# Altium project Servo.PrjPcb
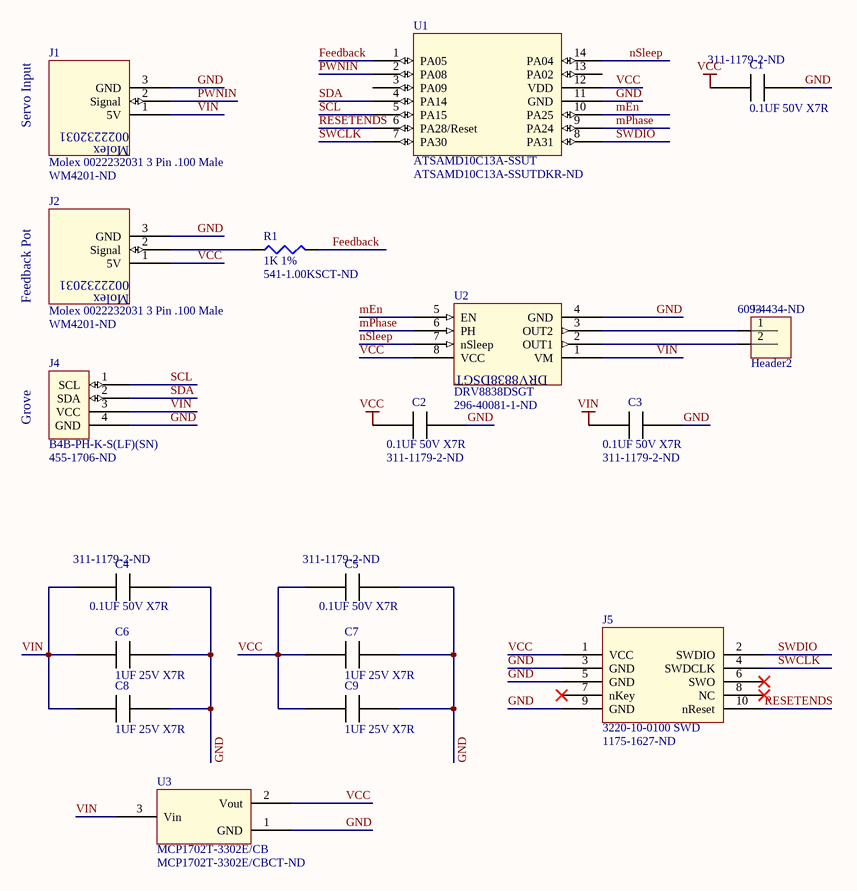
[diagram p0: Sheet1_servo.SchDoc]
1 sheet, 18 parts. Net scope: global (net labels, ports and power ports of the same name join across sheets).

## Sheet Sheet1_servo.SchDoc: Servo1 Controller
size A; Date: Jan 3, 2015; CompanyName: Neural Cloud Computing Pte Ltd; DrawnBy: Glenn West; Engineer: Glenn West; DocumentNumber: 1200-1; DocumentName: ServoController1; ProjectName: Servo1

### Parts
C1  0.1UF 50V X7R  Supplier Part Number 1: 311-1179-2-ND  [C1206YageoX7R]
C2  0.1UF 50V X7R  Supplier Part Number 1: 311-1179-2-ND  [C1206YageoX7R]
C3  0.1UF 50V X7R  Supplier Part Number 1: 311-1179-2-ND  [C1206YageoX7R]
C4  0.1UF 50V X7R  Supplier Part Number 1: 311-1179-2-ND  [C1206YageoX7R]
C5  0.1UF 50V X7R  Supplier Part Number 1: 311-1179-2-ND  [C1206YageoX7R]
C6  1UF 25V X7R  [C1206YageoX7R]
C7  1UF 25V X7R  [C1206YageoX7R]
C8  1UF 25V X7R  [C1206YageoX7R]
C9  1UF 25V X7R  [C1206YageoX7R]
J1  Molex 0022232031 3 Pin .100 Male  Supplier Part Number 1: WM4201-ND  [022232031]
J2  Molex 0022232031 3 Pin .100 Male  Supplier Part Number 1: WM4201-ND  [022232031]
J3  Header2  Supplier Part Number 1: 609-4434-ND  [77311-118-02LF]
J4  B4B-PH-K-S(LF)(SN)  Supplier Part Number 1: 455-1706-ND  [B4B-PH-K-S(LF)(SN)]
J5  3220-10-0100 SWD  Supplier Part Number 1: 1175-1627-ND  [3220-10-0100]
R1  1K 1%  Supplier Part Number 1: 541-1.00KSCT-ND  [J1-0603]
U1  ATSAMD10C13A-SSUT  Supplier Part Number 1: ATSAMD10C13A-SSUTDKR-ND  [ATSAMD10C13A]
U2  DRV8838DSGT  Supplier Part Number 1: 296-40081-1-ND  [DRV8838DSGT]
U3  MCP1702T-3302E/CB  Supplier Part Number 1: MCP1702T-3302E/CBCT-ND  [MCP1702-SOT-23A]

### Nets
GND: C1.2 C2.2 C3.2 C4.2 C5.2 C6.2 C7.2 C8.2 C9.2 J1.3(GND) J2.3(GND) J4.4(GND) J5.3(GND) J5.5(GND) J5.9(GND) U1.11(GND) U1.15(TPad) U2.4(GND) U2.9(Tpad) U3.1(GND)
VCC: C1.1 C2.1 C5.1 C7.1 C9.1 J2.1(5V) J5.1(VCC) U1.12(VDD) U2.8(VCC) U3.2(Vout)
VIN: C3.1 C4.1 C6.1 C8.1 J1.1(5V) J4.3(VCC) U2.1(VM) U3.3(Vin)
Feedback: R1.2 U1.1(PA05)
mEn: U1.10(PA25) U2.5(EN)
mPhase: U1.9(PA24) U2.6(PH)
nSleep: U1.14(PA04) U2.7(nSleep)
PWNIN: J1.2(Signal) U1.2(PA08)
RESETENDS: J5.10(nReset) U1.6(PA28/Reset)
SCL: J4.1(SCL) U1.5(PA15)
SDA: J4.2(SDA) U1.4(PA14)
SWCLK: J5.4(SWDCLK) U1.7(PA30)
SWDIO: J5.2(SWDIO) U1.8(PA31)
NetJ2_2: J2.2(Signal) R1.1
NetJ3_1: J3.1 U2.3(OUT2)
NetJ3_2: J3.2 U2.2(OUT1)

Not connected (* = marked no-connect by the designer): J5 6(SWO)* 7(nKey)* 8(NC)*; U1 3(PA09) 13(PA02)

### Notes on the sheet
- Servo Input
- Feedback Pot
- Grove
- (in symbol Conn3Pin) 0022232031; Molex

### Library data of the parts
C1-C5 = CC1206KRX7R9BB104: CAP CER 0.1UF 50V X7R 1206 YAGEO CC1206KRX7R9BB104; Supplier 1: Digi-Key
C6-C9 = CC1206KKX7R8BB105: CAP CER 1UF 25V X7R 1206 Yageo CC1206KKX7R8BB105; Supplier 1: Digi-Key; Supplier Part Number 1: 311-1356-2-ND
J1 J2 = Conn3Pin: Molex 3 Pin .100 With Retetion; Supplier 1: Digi-Key
J3 = 77311-118-02LF: CONN HEADER 2POS VERT T/H FCI 77311-118-02LF; Supplier 1: Digi-Key
J5 = 3220-10-0100-00: HiRose 3220-10-0100 BOX HEADER, 0.050 10 POS; Supplier 1: Digi-Key
R1 = CRCW06031K00FKEAHP: Resistor 1K 1% 0603 CRCW06031K00FKEAHP; Published: 8-Jun-2000; LatestRevisionDate: 29-May-2009; LatestRevisionNote: IPC-7351 Footprint Added.; PackageReference: J1-0603; Publisher: Altium Limited; PackageDescription: Chip Resistor; Value: 1K; Supplier 1: Digi-Key
U1 = ATSAMD10C13A: IC MCU 32BIT 8KB FLASH 14SOIC; Supplier 1: Digi-Key
U2 = DRV8838DSGT: IC BRIDGE DRIVER PAR 8WSON; Supplier 1: Digi-Key
U3 = MCP1702: IC REG LDO 3.3V 0.25A SOT23A-3 Microchip MCP1702T-3302E/CB; Supplier 1: Digi-Key
J4 = B4B-PH-K-S(LF)(SN): Supplier 1: Digi-Key